# Altium schematic sheet SMD Brushed Motor Driver V3.SchDoc
size A3; SheetNumber: 2; SheetTotal: 2
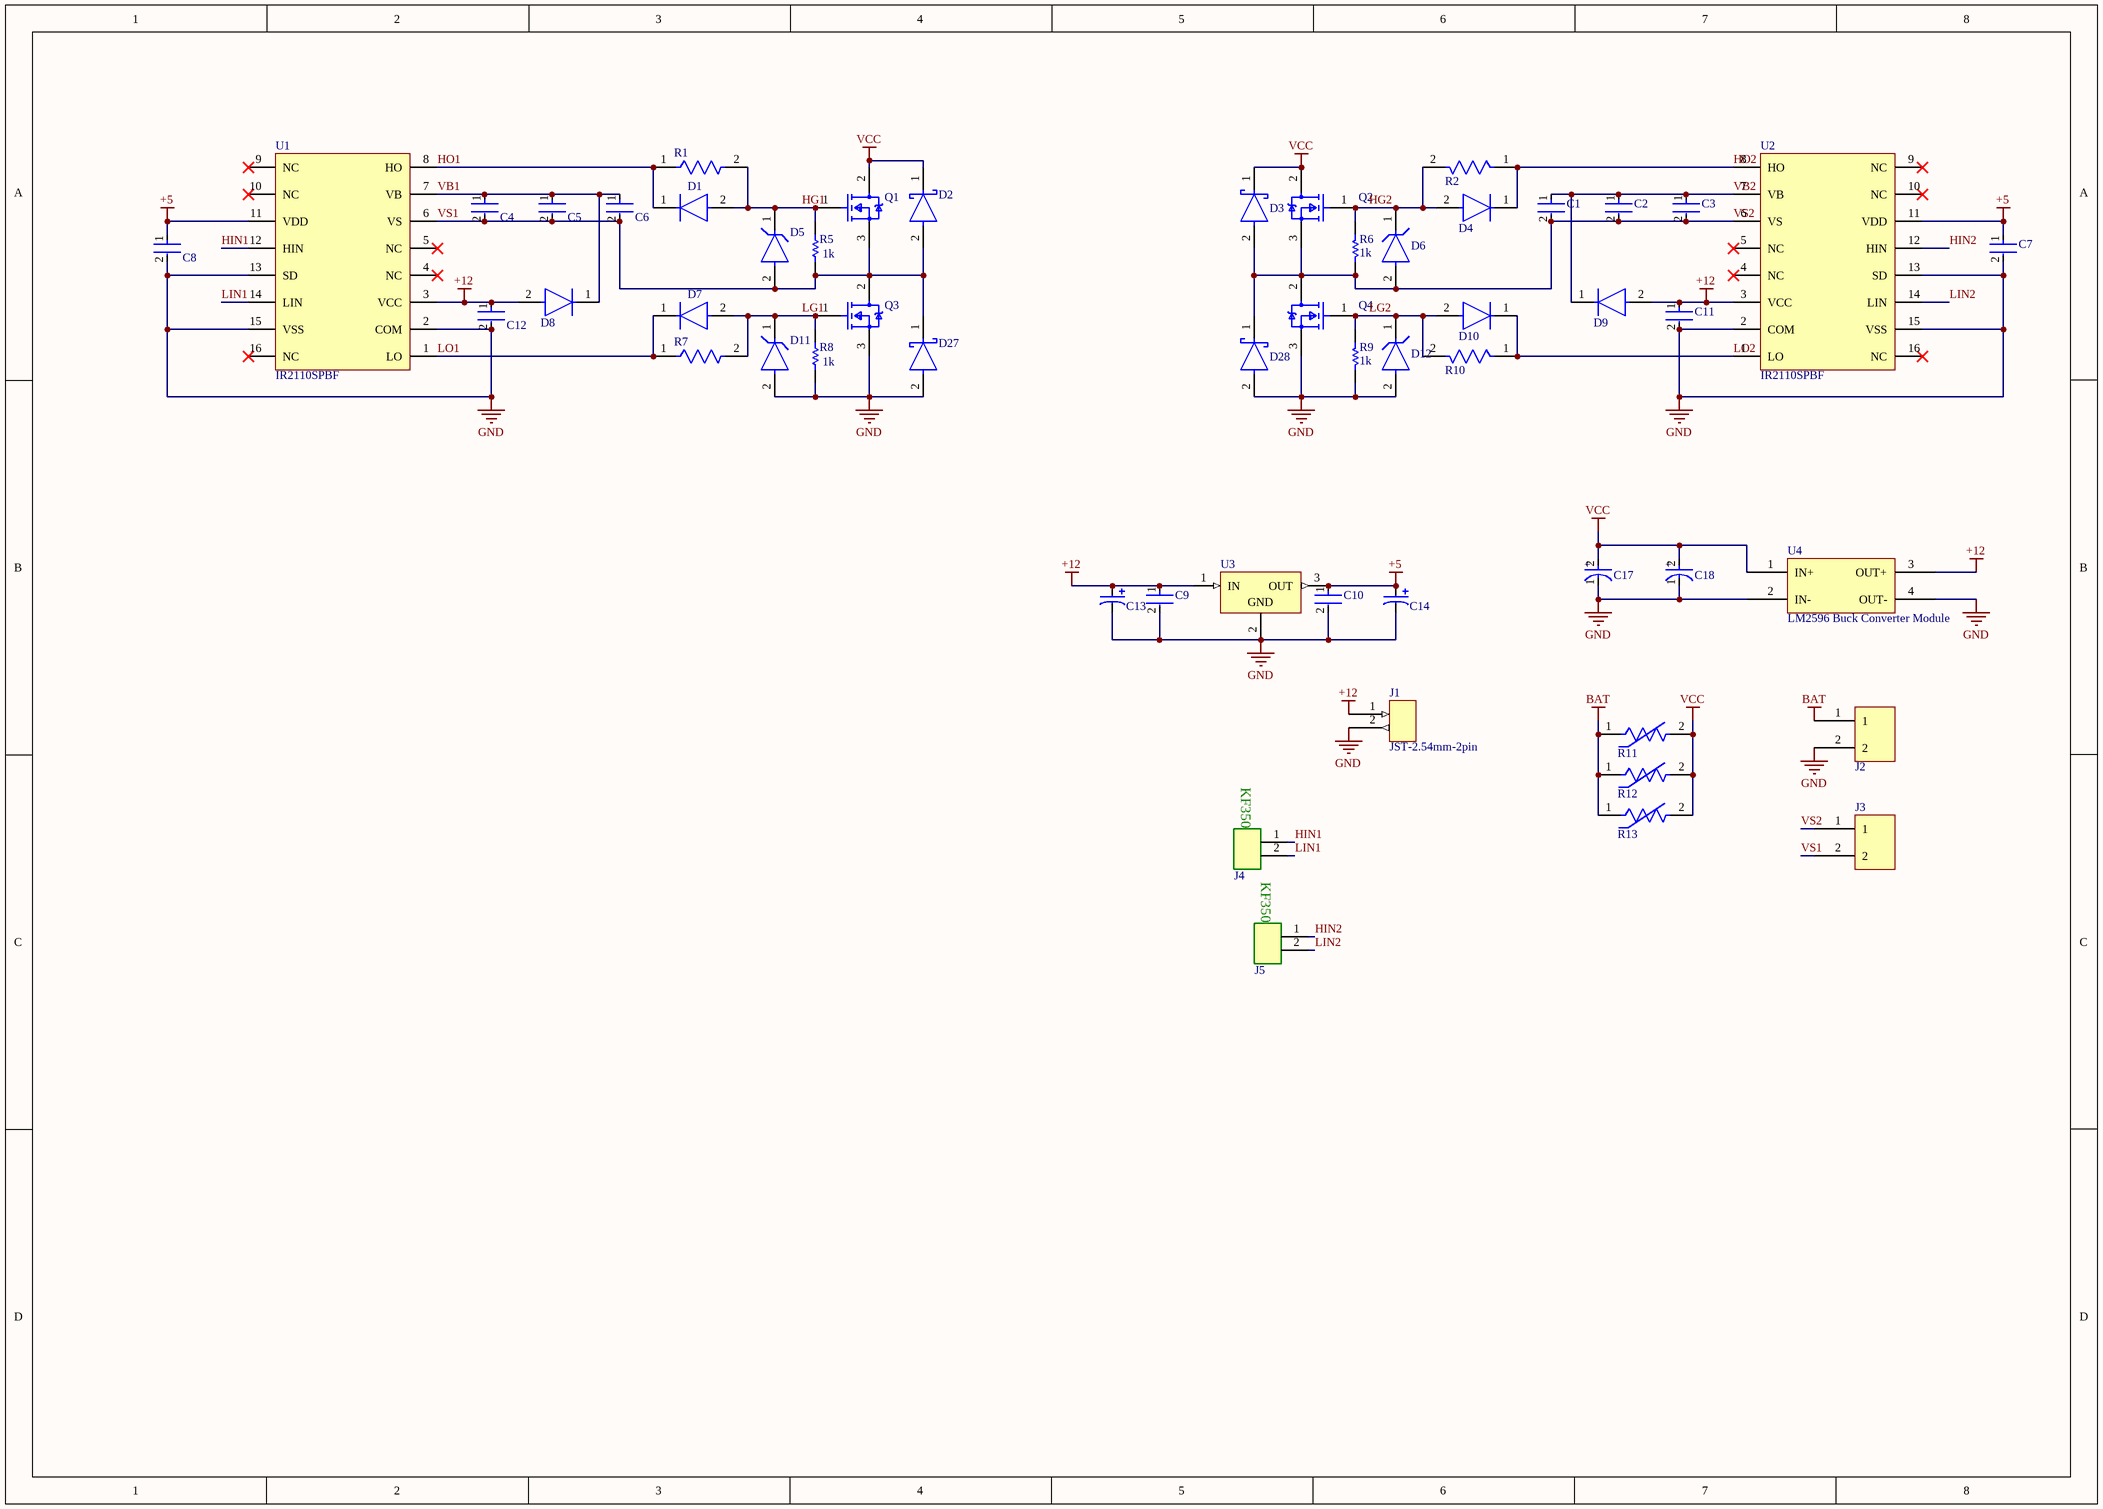
[diagram p0: SMD Brushed Motor Driver V3.SchDoc]

## Parts
C1  12061C474KAT2A  [FP-1206-L_3_2_0_2-W_1_6_0-IPC_B]  (value not drawn)
C2  12061C474KAT2A  [FP-1206-L_3_2_0_2-W_1_6_0-IPC_B]  (value not drawn)
C3  12061C474KAT2A  [FP-1206-L_3_2_0_2-W_1_6_0-IPC_B]  (value not drawn)
C4  12061C474KAT2A  [FP-1206-L_3_2_0_2-W_1_6_0-IPC_B]  (value not drawn)
C5  12061C474KAT2A  [FP-1206-L_3_2_0_2-W_1_6_0-IPC_B]  (value not drawn)
C6  12061C474KAT2A  [FP-1206-L_3_2_0_2-W_1_6_0-IPC_B]  (value not drawn)
C7  12065C104KAT2A  [FP-1206-L_3_2_0_2-W_1_6_0-IPC_B]  (value not drawn)
C8  12065C104KAT2A  [FP-1206-L_3_2_0_2-W_1_6_0-IPC_B]  (value not drawn)
C9  12065C104KAT2A  [FP-1206-L_3_2_0_2-W_1_6_0-IPC_B]  (value not drawn)
C10  12065C104KAT2A  [FP-1206-L_3_2_0_2-W_1_6_0-IPC_B]  (value not drawn)
C11  12065C104KAT2A  [FP-1206-L_3_2_0_2-W_1_6_0-IPC_B]  (value not drawn)
C12  12065C104KAT2A  [FP-1206-L_3_2_0_2-W_1_6_0-IPC_B]  (value not drawn)
C13  22 uF TH Electrolytic Capacitor  [22 uF TH Electrolytic Capacitor-Footprint-1]  (value not drawn)
C14  22 uF TH Electrolytic Capacitor  [22 uF TH Electrolytic Capacitor-Footprint-1]  (value not drawn)
C17  ECA1VM222  [FP-RAD-TH-D_16_0_5-L_25_2-MFG]  (value not drawn)
C18  ECA1VM222  [FP-RAD-TH-D_16_0_5-L_25_2-MFG]  (value not drawn)
D1  MURS120T3G  [FP-403A-03-MFG]  (value not drawn)
D2  SS34-E3/57T  [FP-95402-MFG]  (value not drawn)
D3  SS34-E3/57T  [FP-95402-MFG]  (value not drawn)
D4  MURS120T3G  [FP-403A-03-MFG]  (value not drawn)
D5  TZMC3V3-GS08  [FP-6_560-5005_01-4-MFG]  (value not drawn)
D6  TZMC3V3-GS08  [FP-6_560-5005_01-4-MFG]  (value not drawn)
D7  MURS120T3G  [FP-403A-03-MFG]  (value not drawn)
D8  MURS120T3G  [FP-403A-03-MFG]  (value not drawn)
D9  MURS120T3G  [FP-403A-03-MFG]  (value not drawn)
D10  MURS120T3G  [FP-403A-03-MFG]  (value not drawn)
D11  TZMC3V3-GS08  [FP-6_560-5005_01-4-MFG]  (value not drawn)
D12  TZMC3V3-GS08  [FP-6_560-5005_01-4-MFG]  (value not drawn)
D27  SS34-E3/57T  [FP-95402-MFG]  (value not drawn)
D28  SS34-E3/57T  [FP-95402-MFG]  (value not drawn)
J1  JST-2.54mm-2pin  [New footprint 1]
J2  2 pin terminal klemens  [New footprint 1]  (value not drawn)
J3  2 pin terminal klemens  [New footprint 1]  (value not drawn)
J4  KF350-P2  [New footprint 1]  (value not drawn)
J5  KF350-P2  [New footprint 1]  (value not drawn)
Q1  IRF3205STRLPBF  [FP-PG-TO263-3-MFG]  (value not drawn)
Q2  IRF3205STRLPBF  [FP-PG-TO263-3-MFG]  (value not drawn)
Q3  IRF3205STRLPBF  [FP-PG-TO263-3-MFG]  (value not drawn)
Q4  IRF3205STRLPBF  [FP-PG-TO263-3-MFG]  (value not drawn)
R1  RC1206JR-0710RL  [FP-RC1206-0_65-MFG]  (value not drawn)
R2  RC1206JR-0710RL  [FP-RC1206-0_65-MFG]  (value not drawn)
R5  value 1k  [RESC3116X70X50ML13T20]  (hidden comment: Resistor 1k +/-1% 1206 250 mW)
R6  value 1k  [RESC3116X70X50ML13T20]  (hidden comment: Resistor 1k +/-1% 1206 250 mW)
R7  RC1206JR-0710RL  [FP-RC1206-0_65-MFG]  (value not drawn)
R8  value 1k  [RESC3116X70X50ML13T20]  (hidden comment: Resistor 1k +/-1% 1206 250 mW)
R9  value 1k  [RESC3116X70X50ML13T20]  (hidden comment: Resistor 1k +/-1% 1206 250 mW)
R10  RC1206JR-0710RL  [FP-RC1206-0_65-MFG]  (value not drawn)
R11  20mm Body 7.5mm pitch Thermistor  [FP-NTPAD-MFG]  (value not drawn)
R12  20mm Body 7.5mm pitch Thermistor  [FP-NTPAD-MFG]  (value not drawn)
R13  20mm Body 7.5mm pitch Thermistor  [FP-NTPAD-MFG]  (value not drawn)
U1  IR2110SPBF  [IR2110SPBF-Footprint-1]
U2  IR2110SPBF  [IR2110SPBF-Footprint-1]
U3  LM7805CT  [FAIR-TO-220-3]  (value not drawn)
U4  LM2596 Buck Converter Module  [LM2596 Buck Converter Module-Footprint-1]

## Nets
+5: C7.1 C8.1 C10.1 C14.1 U1.11(VDD) U2.11(VDD) U3.3(OUT)
+12: C9.1 C11.1 C12.1 C13.1 D8.2(A) D9.2(A) J1.1 U1.3(VCC) U2.3(VCC) U3.1(IN) U4.3(OUT+)
BAT: J2.1 R11.1 R12.1 R13.1
GND: C7.2 C8.2 C9.2 C10.2 C11.2 C12.2 C13.2 C14.2 C17.1(C) C18.1(C) D11.2(A) D12.2(A) D27.2(A) D28.2(A) J1.2 J2.2 Q3.3(S) Q4.3(S) R8.2 R9.2 U1.2(COM) U1.13(SD) U1.15(VSS) U2.2(COM) U2.13(SD) U2.15(VSS) U3.2(GND) U4.2(IN-) U4.4(OUT-)
VCC: C17.2(A) C18.2(A) D2.1(C) D3.1(C) Q1.2(D) Q2.2(D) R11.2 R12.2 R13.2 U4.1(IN+)
HG1: D1.2(A) D5.1(C) Q1.1(G) R1.2 R5.1
HG2: D4.2(A) D6.1(C) Q2.1(G) R2.2 R6.1
HIN1: J4.1 U1.12(HIN)
HIN2: J5.1 U2.12(HIN)
HO1: D1.1(C) R1.1 U1.8(HO)
HO2: D4.1(C) R2.1 U2.8(HO)
LG1: D7.2(A) D11.1(C) Q3.1(G) R7.2 R8.1
LG2: D10.2(A) D12.1(C) Q4.1(G) R9.1 R10.2
LIN1: J4.2 U1.14(LIN)
LIN2: J5.2 U2.14(LIN)
LO1: D7.1(C) R7.1 U1.1(LO)
LO2: D10.1(C) R10.1 U2.1(LO)
VB1: C4.1 C5.1 C6.1 D8.1(C) U1.7(VB)
VB2: C1.1 C2.1 C3.1 D9.1(C) U2.7(VB)
VS1: C4.2 C5.2 C6.2 D2.2(A) D5.2(A) D27.1(C) J3.2 Q1.3(S) Q3.2(D) R5.2 U1.6(VS)
VS2: C1.2 C2.2 C3.2 D3.2(A) D6.2(A) D28.1(C) J3.1 Q2.3(S) Q4.2(D) R6.2 U2.6(VS)

Not connected (* = marked no-connect by the designer): U1 4(NC)* 5(NC)* 9(NC)* 10(NC)* 16(NC)*; U2 4(NC)* 5(NC)* 9(NC)* 10(NC)* 16(NC)*

## Notes on the sheet
- (in symbol CMP-002-00078-2) KF350
- (in symbol CMP-000011-3) +

## Library data of the parts
C1-C6 = CMP-000013-1: 1206 470 nF 100 V ±10 % Tolerance X7R Surface Mount Multilayer Ceramic Capacitor
C7-C12 = CMP-001-00084-1: Ceramic capacitor SMD-1206 100nF /50V X7R# K +-10%, AVX, RoHS, /4000 reel/
C13 C14 = CMP-000003-2
C17 C18 = CMP-000011-3: Cap Aluminum 2200uF 35V 20% (16 X 25mm) Radial 7.5mm 1250mA 2000h 85°C Bulk
D1 D4 D7-D10 = CMP-004-00033-1: VR=200V IF=2A Trr=35ns
D2 D3 D27 D28 = CMP-000005-2: DIODE SCHOTTKY 40V 3A DO214AB
D5 D6 D11 D12 = CMP-000009-1: DIODE ZENER 3.3V 500MW SOD80
J1 = CMP-000001-1: 2 pin konnektör
J2 J3 = CMP-002-00072-2: 2 pin terminal klemens pin aralığı 200 mil
J4 J5 = CMP-002-00078-2: 3.5mm mini klemens
Q1-Q4 = CMP-013-00038-1: MOSFET N-CH 55V 110A D2PAK
R1 R2 R7 R10 = CMP-000008-1: Res General Purpose Thick Film 1206 10 Ohm 5% 1/4W ±200ppm/°C Molded SMD Paper T/R
R5 R6 R8 R9 = CMP-009-00011-5: Chip Resistor, 1 KOhm, +/- 1%, 0.25 W, -55 to 155 degC, 1206 (3216 Metric); Voltage Rating: 200V; Power: 250mW; Max Operating Temperature: 155°C; Mounting Technology: SM; Tolerance: 1%; Case/Package: 1206; RoHS Compliant: True; Min Operating Temperature: -55°C; Pins: 2
R11-R13 = CMP-009-00184-2
U1 U2 = CMP-000016-1: 500 V high-side and low-side gate driver IC with shutdown, SOIC 16W, RoHS
U3 = CMP-000017-2: LM78XX Series 5 V Fixed Output 1 A 3-Terminal LDO Voltage Regulator - TO-220
U4 = CMP-00000-1